# Altium project micromouse_a_DAT.PrjPcb
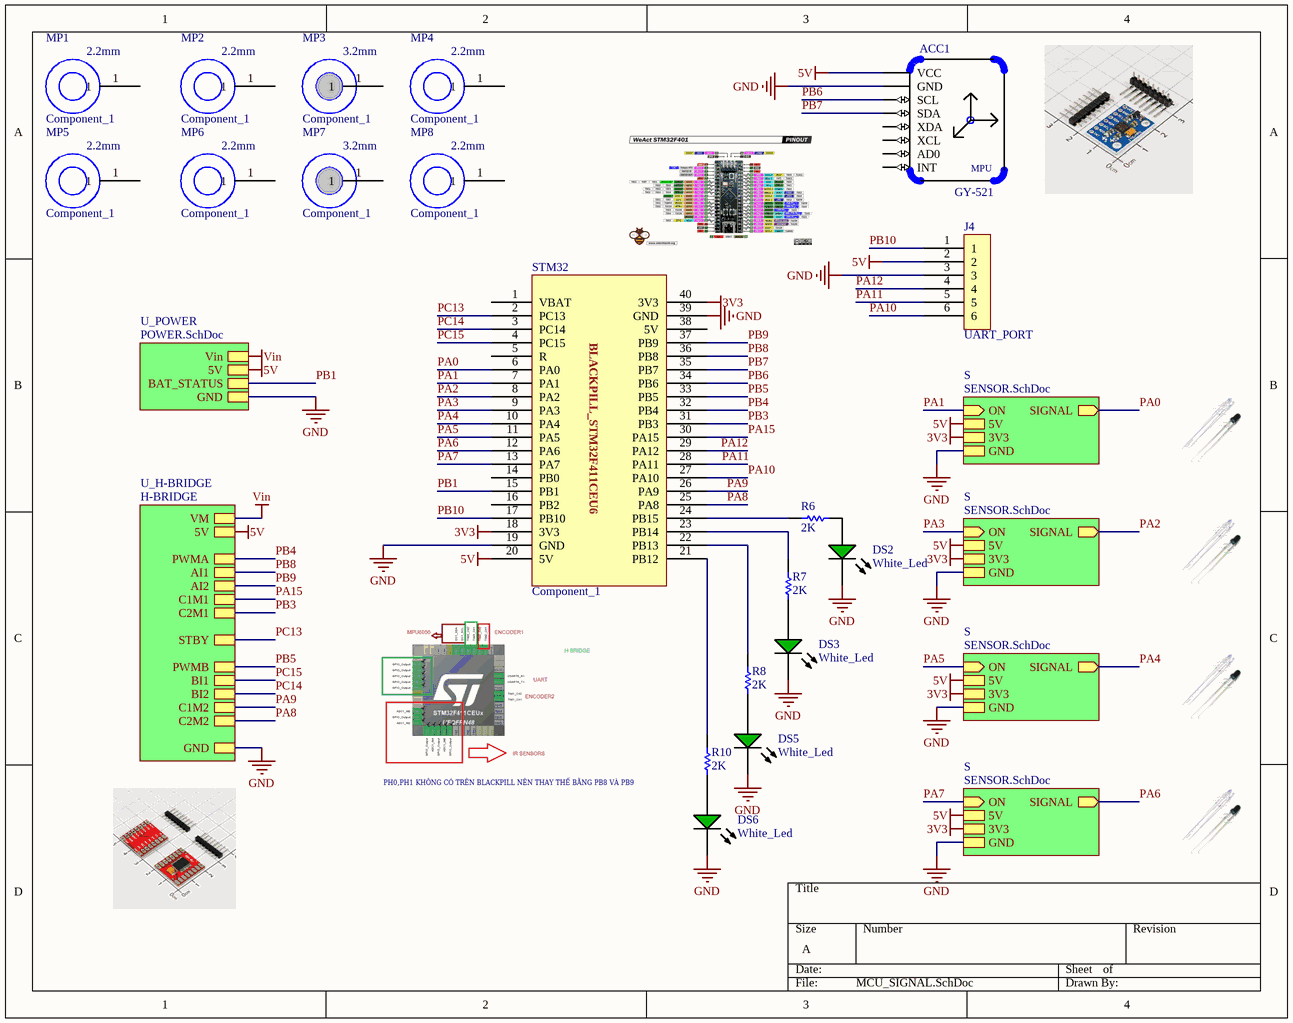
[diagram p0: MCU_SIGNAL.SchDoc]
4 sheets, 70 parts. Net scope: hierarchical (ports join the sheet entries above them; power ports are global).
Board file: PCB1.PcbDoc
Sheets:
  MCU_SIGNAL.SchDoc
    U_H-BRIDGE = H-BRIDGE.SchDoc
    S = SENSOR.SchDoc
    S = SENSOR.SchDoc
    S = SENSOR.SchDoc
    S = SENSOR.SchDoc
    U_POWER = POWER.SchDoc

## Sheet MCU_SIGNAL.SchDoc
size A; SheetNumber: 1; SheetTotal: 4

### Parts
ACC1  GY-521  [*GY-521_GY-521(Primary)]
DS2  White_Led  [AVAG-HSMX-C170_V]
DS3  White_Led  [AVAG-HSMX-C170_V]
DS5  White_Led  [AVAG-HSMX-C170_V]
DS6  White_Led  [AVAG-HSMX-C170_V]
J4  UART_PORT  [HDR Female 1~6 2.54mm]
MP1  Component_1  [PCBComponent_1]
MP2  Component_1  [PCBComponent_1]
MP3  Component_1  [PCBComponent_1]
MP4  Component_1  [PCBComponent_1]
MP5  Component_1  [PCBComponent_1]
MP6  Component_1  [PCBComponent_1]
MP7  Component_1  [PCBComponent_1]
MP8  Component_1  [PCBComponent_1]
R6  2K  [RESC2013X60X35ML10T20]
R7  2K  [RESC2013X60X35ML10T20]
R8  2K  [RESC2013X60X35ML10T20]
R10  2K  [RESC2013X60X35ML10T20]
STM32  Component_1  [MODULE_ZC323000]

### Sub-sheets
S = SENSOR.SchDoc: ON (in), SIGNAL (out), 5V, GND, 3V3
S = SENSOR.SchDoc: ON (in), SIGNAL (out), 5V, GND, 3V3
S = SENSOR.SchDoc: ON (in), SIGNAL (out), 5V, GND, 3V3
S = SENSOR.SchDoc: ON (in), SIGNAL (out), 5V, GND, 3V3
U_H-BRIDGE = H-BRIDGE: VM, 5V, PWMA, AI1, AI2, STBY, BI1, BI2, PWMB, GND, C1M1, C2M1, C1M2, C2M2
U_POWER = POWER.SchDoc: 5V, GND, Vin, BAT_STATUS

### Nets
3V3: STM32.18(3V3) STM32.40(3V3) ; sheet S/3V3, sheet S/3V3, sheet S/3V3, sheet S/3V3
5V: ACC1.VCC J4.2 STM32.20(5V) ; sheet U_H-BRIDGE/5V, sheet S/5V, sheet S/5V, sheet S/5V, sheet S/5V, sheet U_POWER/5V
GND: ACC1.GND DS2.2(K) DS3.2(K) DS5.2(K) DS6.2(K) J4.3 STM32.19(GND) STM32.39(GND) ; sheet U_H-BRIDGE/GND, sheet S/GND, sheet S/GND, sheet S/GND, sheet S/GND, sheet U_POWER/GND
Vin: sheet U_H-BRIDGE/VM, sheet U_POWER/Vin
PA0: STM32.6(PA0) ; sheet S/SIGNAL
PA1: STM32.7(PA1) ; sheet S/ON
PA2: STM32.8(PA2) ; sheet S/SIGNAL
PA3: STM32.9(PA3) ; sheet S/ON
PA4: STM32.10(PA4) ; sheet S/SIGNAL
PA5: STM32.11(PA5) ; sheet S/ON
PA6: STM32.12(PA6) ; sheet S/SIGNAL
PA7: STM32.13(PA7) ; sheet S/ON
PA8: STM32.25(PA8) ; sheet U_H-BRIDGE/C2M2
PA9: STM32.26(PA9) ; sheet U_H-BRIDGE/C1M2
PA10: J4.6 STM32.27(PA10)
PA11: J4.5 STM32.28(PA11)
PA12: J4.4 STM32.29(PA12)
PA15: STM32.30(PA15) ; sheet U_H-BRIDGE/C1M1
PB1: STM32.15(PB1) ; sheet U_POWER/BAT_STATUS
PB3: STM32.31(PB3) ; sheet U_H-BRIDGE/C2M1
PB4: STM32.32(PB4) ; sheet U_H-BRIDGE/PWMA
PB5: STM32.33(PB5) ; sheet U_H-BRIDGE/PWMB
PB6: ACC1.SCL STM32.34(PB6)
PB7: ACC1.SDA STM32.35(PB7)
PB8: STM32.36(PB8) ; sheet U_H-BRIDGE/AI1
PB9: STM32.37(PB9) ; sheet U_H-BRIDGE/AI2
PB10: J4.1 STM32.17(PB10)
PC13: STM32.2(PC13) ; sheet U_H-BRIDGE/STBY
PC14: STM32.3(PC14) ; sheet U_H-BRIDGE/BI2
PC15: STM32.4(PC15) ; sheet U_H-BRIDGE/BI1
NetDS2_1: DS2.1(A) R6.2
NetDS3_1: DS3.1(A) R7.1
NetDS5_1: DS5.1(A) R8.1
NetDS6_1: DS6.1(A) R10.1
NetR6_1: R6.1 STM32.24(PB15)
NetR7_2: R7.2 STM32.23(PB14)
NetR8_2: R8.2 STM32.22(PB13)
NetR10_2: R10.2 STM32.21(PB12)

Not connected (* = marked no-connect by the designer): ACC1 AD0 INT XCL XDA; MP1 1; MP2 1; MP3 1; MP4 1; MP5 1; MP6 1; MP7 1; MP8 1; STM32 1(VBAT) 5(R) 14(PB0) 16(PB2) 38(5V)

### Notes on the sheet
- PH0,PH1 KHÔNG CÓ TRÊN BLACKPILL NÊN THAY THẾ BẰNG PB8 VÀ PB9
- (in symbol Component_1) BLACKPILL_STM32F411CEU6; 2.2mm; 3.2mm
- (in symbol GY-521) MPU

### Library data of the parts
ACC1 = GY-521: Triple Axis Accelerometer Gyro Breakout; MF: GODREAM FORDREAM CO., LIMITED; SnapEDA_Link: https://www.snapeda.com/parts/GY-521/GODREAM+FORDREAM+CO.%252C+LIMITED/view-part/?ref=snap; Package: Package; MP: GY-521; Check_prices: https://www.snapeda.com/parts/GY-521/GODREAM+FORDREAM+CO.%252C+LIMITED/view-part/?ref=eda; Value: *
DS2 DS3 DS5 DS6 = CMP-2000-05062-1: Chip LED, Green, 2.2 V, -40 to 85 degC, 2-Pin SMD, Pb-Free, Tape and Reel; Manufacturer: Avago; No. of Pins: 2; Peak Wavelength: 570nm; SVHC: NoSVHC(16-Jun-2014); Dominant Wavelength: 572nm; Forward Current If: 20mA; Viewing Angle: 170deg; Lens Shape: Rectangular; PIV Max: 5V; External Width: 1.25mm; LED Type: Standard; External Depth: 0.8mm; Opto Mounting Orientation: Top; Luminous Intensity: 15mcd; Luminous Intensity Min: 4mcd; Forward Voltage VF Max: 2.6V; External Length / Height: 2mm; Bulb Size: 1.25mmx1.4mm; Light Area Height: 1mm; Voltage Vf Typ: 2.2V; Operating Temperature Max: 85degC; Datasheet Version: Oct-08; MSL: MSL2A-4weeks; Peak Forward Current: 20mA; Package Description: 2-Pin Surface Mount Device, Body 2 x 1.25 mm, Height 0.8 mm; Datasheet URL: https://datasheet.ciiva.com/29280/180495-da-01-en-chip-led-hsmg-c170-gelb-gruen-29280971.pdf; Storage Temperature Min: -40degC; LED Colour: Green; Wavelength Typ: 570nm; Mounting Type: SMD; Forward Current If Max: 20mA; Dominant Wavelength Typ: 572nm; LED Mounting: SMD; Operating Temperature Range: -30degCto+85degC; Operating Temperature Min: -30degC; Manufacturer URL: http://www.avagotech.com/; Packaging: CutTape; Luminous Intensity Typ: 15mcd; Package Reference: HSMX-C170; Storage Temperature Max: 85degC; Opto Case Style: SMD; Forward Voltage: 2.2V
J4 = M20-7820646: 06-WAY SIL VERT SOCKET L/FREE; Manufacturer: Harwin; Number of Contacts: 6; Gender: Female; Connector Type: Receptacle,Socket; Max Current Rating: 3A; Contact Resistance: 20mR; Pitch: 2.54mm; Manufacturer Part Number: M20-7820646; RoHS: Yes; Category: Headers and Wire Housings; Stock 1: 1563; Pricing 1: 1=0,96000, 10=0,84200, 100=0,72600, 500=0,59400, 1000=0,52800, 5000=0,46200, 10000=0,43890 (USD); Mount: Through Hole; Case/Package: SIL; Housing Material: Nylon; Color: Black; Contact Plating: Tin; Contact Material: Bronze; Housing Color: Black; Min Operating Temperature: -40°C; Max Operating Temperature: 105°C; Termination: Solder; Number of Rows: 1; Number of Positions: 6; Packaging: Rail/Tube; Orientation: Straight; Contact Gender: Female; Package Quantity: 38; Length: 15.64mm; Depth: 2.5mm; Radiation Hardening: No; ComponentLink1URL: http://components.arrow.com/part/dataview/0323_00725884?src-supplier=Arrow+Europe; ComponentLink1Description: http://components.arrow.com/part/dataview/0323_00725884?src-supplier=Arrow+Europe; ComponentLink2URL: http://www.harwin.com/include/downloads/pdfs/2010PAGE120.PDF?src-supplier=Avnet; ComponentLink2Description: http://www.harwin.com/include/downloads/pdfs/2010PAGE120.PDF?src-supplier=Avnet; ComponentLink3URL: https://cdn.harwin.com/pdfs/M20-782.pdf?src-supplier=Digi-Key; ComponentLink3Description: https://cdn.harwin.com/pdfs/M20-782.pdf?src-supplier=Digi-Key; ComponentLink4URL: https://cdn.harwin.com/pdfs/Harwin_PC_Connectors_M20.pdf?src-supplier=Avnet+Europe; ComponentLink4Description: https://cdn.harwin.com/pdfs/Harwin_PC_Connectors_M20.pdf?src-supplier=Avnet+Europe; ComponentLink5URL: https://cdn.harwin.com/pdfs/Harwin_PC_Connectors_M20.pdf?src-supplier=RSComponents; ComponentLink5Description: https://cdn.harwin.com/pdfs/Harwin_PC_Connectors_M20.pdf?src-supplier=RSComponents; ComponentLink6URL: https://cdn.harwin.com/pdfs/Harwin_PC_Connectors_M20.pdf?src-supplier=Mouser; ComponentLink6Description: https://cdn.harwin.com/pdfs/Harwin_PC_Connectors_M20.pdf?src-supplier=Mouser; ComponentLink7URL: https://cdn.harwin.com/pdfs/Harwin_PC_Connectors_M20.pdf?src-supplier=TTI; ComponentLink7Description: https://cdn.harwin.com/pdfs/Harwin_PC_Connectors_M20.pdf?src-supplier=TTI; Supplier 1: Digi-Key; Supplier Part Number 1: 952-1809-ND
R6-R8 R10 = CMP-2100-03671-1: Chip Resistor, 1 KOhm, +/- 1%, 125 mW, -55 to 155 degC, 0805 (2012 Metric), RoHS, Tape and Reel; Manufacturer: Yageo; Temperature Coefficient: 100ppm/degreesC; Voltage Rating (DC): 150V; Max Power Dissipation: 125mW; Resistance: 1KOhm; Number of Pins: 2; Number of Terminations: 2; Datasheet URL: http://www.yageo.com/NewPortal/yageodocoutput?fileName=/pdf/R-Chip/PYu-RC_Group_51_RoHS_L_5.pdf; Length: 0.079inch; Package Description: 2-Pin Surface Mounted Device, Body 2 x 1.25 mm; Depth: 1.25mm; Height: 0.024inch; Military Standard: Not; Case/Package: 0805; Package Reference: 0805; RoHSCompliant: true; Lead Free: LeadFree; Packaging: TapeandReel; Package Quantity: 1; Datasheet Version: Rev. 5, 10/2016; Tolerance: 1%; Min Operating Temperature: -55degC; Voltage Rating: 150V; Composition: ThickFilm; Case Code (Imperial): 0805; Power Rating: 125mW; Width: 0.049inch; Case Code (Metric): 2012; Manufacturer URL: http://www.yageo.com/; Max Operating Temperature: 155degC; REACH SVHC: Unknown; Termination: SMD/SMT

## Sheet H-BRIDGE.SchDoc
size A; SheetNumber: 3; SheetTotal: 4
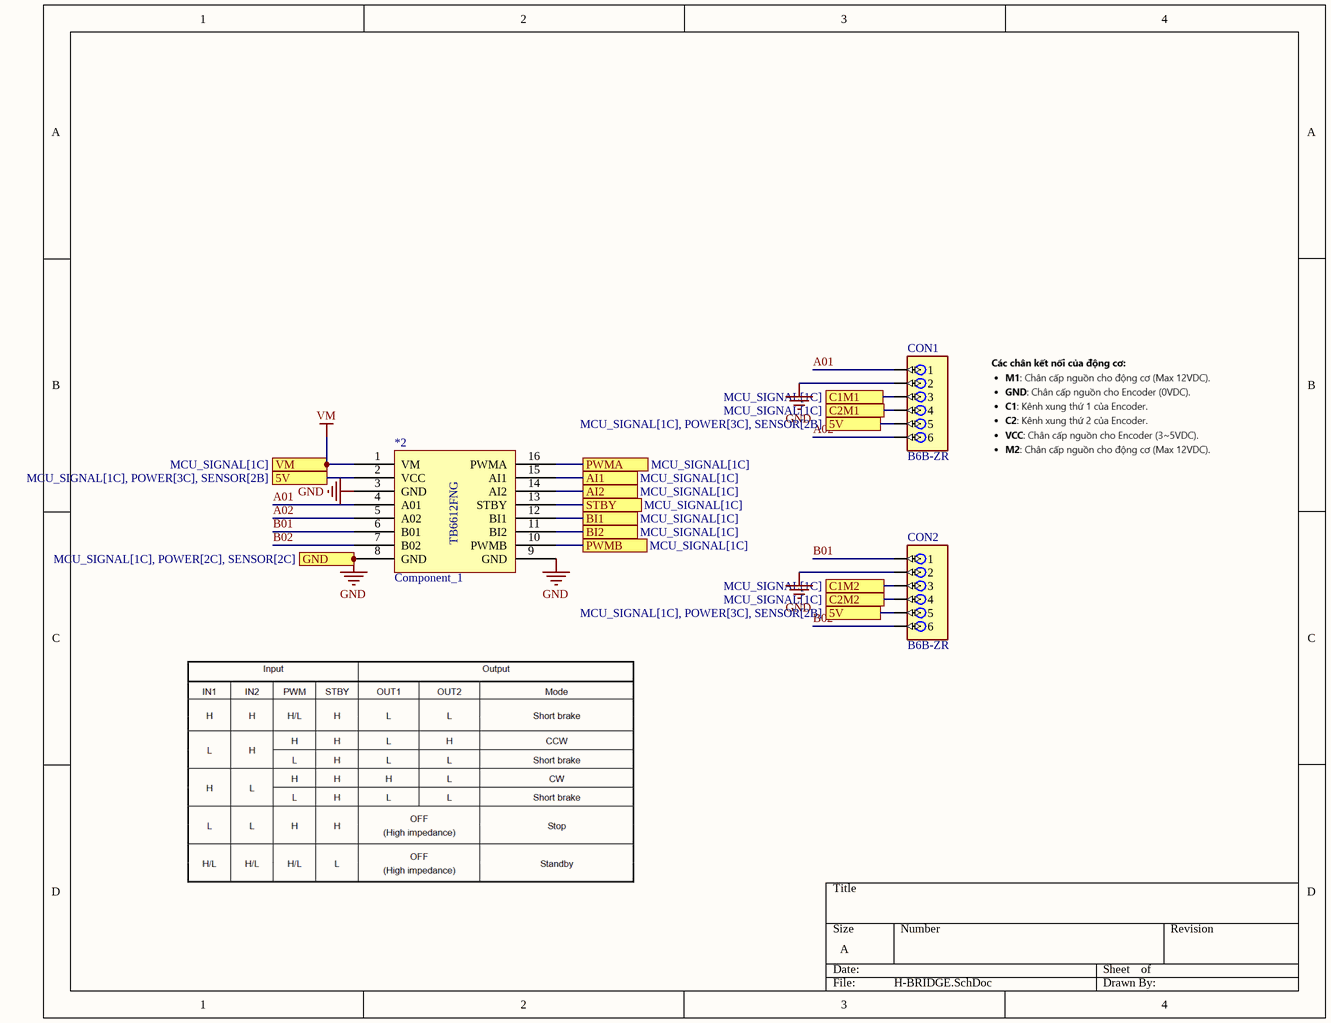
[diagram p1: H-BRIDGE.SchDoc]

### Parts
*2  Component_1  [PCBComponent_1]
CON1  B6B-ZR  [B6B-ZR]
CON2  B6B-ZR  [B6B-ZR]

### Ports
5V (see MCU_SIGNAL[1C], POWER[3C], SENSOR[2B]), AI1 (see MCU_SIGNAL[1C]), AI2 (see MCU_SIGNAL[1C]), BI1 (see MCU_SIGNAL[1C]), BI2 (see MCU_SIGNAL[1C]), C1M1 (see MCU_SIGNAL[1C]), C1M2 (see MCU_SIGNAL[1C]), C2M1 (see MCU_SIGNAL[1C]), C2M2 (see MCU_SIGNAL[1C]), GND (see MCU_SIGNAL[1C], POWER[2C], SENSOR[2C]), PWMA (see MCU_SIGNAL[1C]), PWMB (see MCU_SIGNAL[1C]), STBY (see MCU_SIGNAL[1C]), VM (see MCU_SIGNAL[1C])

### Nets
5V: *2.2(VCC) CON1.5 CON2.5 ; port 5V
GND: *2.3(GND) *2.8(GND) *2.9(GND) CON1.2 CON2.2 ; port GND
VM: *2.1(VM) ; port VM  [project net Vin]
A01: *2.4(A01) CON1.1
A02: *2.5(A02) CON1.6
B01: *2.6(B01) CON2.1
B02: *2.7(B02) CON2.6
PA8: CON2.4 ; port C2M2
PA9: CON2.3 ; port C1M2
PA15: CON1.3 ; port C1M1
PB3: CON1.4 ; port C2M1
PB4: *2.16(PWMA) ; port PWMA
PB5: *2.10(PWMB) ; port PWMB
PB8: *2.15(AI1) ; port AI1
PB9: *2.14(AI2) ; port AI2
PC13: *2.13(STBY) ; port STBY
PC14: *2.11(BI2) ; port BI2
PC15: *2.12(BI1) ; port BI1

### Notes on the sheet
- (in symbol Component_1) TB6612FNG

### Library data of the parts
CON1 CON2 = B6B-ZR: Connector Header Surface Mount 6 position 0.059 (1.50mm); MF: JST; Value: *; Check_prices: https://www.snapeda.com/parts/B6B-ZR/JST/view-part/?ref=eda; Price: None; MP: B6B-ZR; SnapEDA_Link: https://www.snapeda.com/parts/B6B-ZR/JST/view-part/?ref=snap; Availability: In Stock; Package: None

## Sheet SENSOR.SchDoc
size A; SheetNumber: 2; SheetTotal: 4
Used 4 times, as channels S, S, S, S. Parts and nets are listed once, with the designators drawn on the sheet.
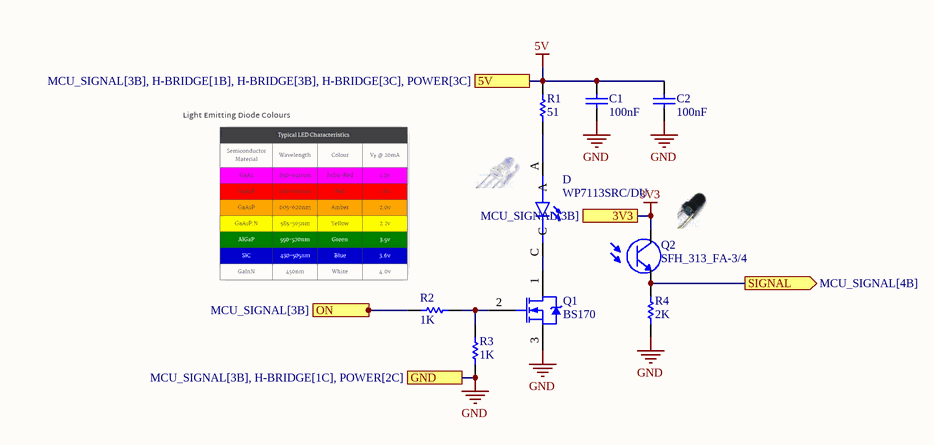
[diagram p2: SENSOR.SchDoc]

### Parts
C1  100nF  [CAPC2013X135X45LL10T25]
C2  100nF  [CAPC2013X135X45LL10T25]
D  WP7113SRC/DU  [LED_WP7113SRC/DU]
Q1  BS170  [ONSC-TO-92-3-29-11]
Q2  SFH_313_FA-3/4  [XDCR_SFH_313_FA-3/4]
R1  51  [RESC2013X60X35ML10T20]
R2  1K  [RESC2013X60X35ML10T20]
R3  1K  [RESC2013X60X35ML10T20]
R4  2K  [RESC2013X60X35ML10T20]

### Ports
3V3 (see MCU_SIGNAL[3B]), 5V (see MCU_SIGNAL[3B], H-BRIDGE[1B], H-BRIDGE[3B], H-BRIDGE[3C], POWER[3C]), GND (see MCU_SIGNAL[3B], H-BRIDGE[1C], POWER[2C]), ON (in, see MCU_SIGNAL[3B]), SIGNAL (out, see MCU_SIGNAL[4B])

### Nets
3V3: Q2.2(C) ; port 3V3
5V: C1.2 C2.2 R1.2 ; port 5V
GND: C1.1 C2.1 Q1.3(S) R3.1 R4.1 ; port GND
ON: R2.2 ; port ON
SIGNAL: Q2.1(E) R4.2 ; port SIGNAL
NetD_A: D.A R1.1
NetD_C: D.C Q1.1(D)
NetQ1_2: Q1.2(G) R2.1 R3.2

### Channels
S: designators end in _S#1; ports 3V3=3V3 5V=5V GND=GND ON=PA1 SIGNAL=PA0
S: designators end in _S#2; ports 3V3=3V3 5V=5V GND=GND ON=PA3 SIGNAL=PA2
S: designators end in _S#3; ports 3V3=3V3 5V=5V GND=GND ON=PA5 SIGNAL=PA4
S: designators end in _S#4; ports 3V3=3V3 5V=5V GND=GND ON=PA7 SIGNAL=PA6

### Library data of the parts
C1 C2 = CMP-1662-00015-2: Chip Capacitor, 4.7 uF, +/- 10%, 16 V, -55 to 85 degC, 0805 (2012 Metric), RoHS, Tape and Reel; PartNumber: GRM21BR61C475KA88L; Voltage Rating (DC): 16 V; Capacitance: 4.7 uF; Type (Capacitors): X5R; Case\/Package: 0805; Pins: 2; DatasheetVersion: 03/2016; REACH SVHC: No SVHC; Tolerance: 10%; Width: 1.25 mm; Mount: Surface Mount; ComponentLink1Description: Manufacturer URL; Case Code (Metric): 2012; PackageDescription: 2-Pin Surface Mount Device, Body 2 x 1.25 mm; Height: 1.25 mm; Voltage Rating: 16 V; Max Operating Temperature: 85 degC; RoHSCompliant: true; Length: 2 mm; ComponentLink1URL: http://www.murata.com/; Mounting Technology: Surface Mount; Packaging: Tape and Reel; Min Operating Temperature: -55 degC; ComponentLink2Description: Datasheet; Case Code (Imperial): 0805; Radiation Hardening: No; Package Quantity: 3000; PackageReference: 0805; ComponentLink2URL: http://search.murata.co.jp/Ceramy/image/img/A01X/G101/ENG/GRM21BR61C475KA88-01.pdf
D = WP7113SRC/DU: Red 640nm LED Indication - Discrete 1.85V Radial; MF: Kingbright; MP: WP7113SRC/DU; Value: *; SnapEDA_Link: https://www.snapeda.com/parts/WP7113SRC/DU/Kingbright/view-part/826988/?ref=snap; Price: None; Package: Radial Kingbright; Availability: Unavailable
Q1 = CMP-1058-00929-1: Small Signal MOSFET, 500 mA, 60 V, N-Channel, 3-Pin TO-92, Bulk Box; Manufacturer: On Semiconductor; VGS Max (V): 20; Configuration: Single; PD Max (W): 0.35; VGS(th) Max (V): 3; ID Max (A): 0.5; V(BR)DSS Min (V): 60; Channel Polarity: N Channel; PackageDescription: 3-Pin Transistor Outline, Body 4.825 x 3.685 mm, Pitch 1.27 mm; Package Type: TO-92; ComponentLink1Description: Manufacturer URL; ComponentLink1URL: http://www.onsemi.com/; DatasheetVersion: Rev. 6; ComponentLink3Description: Package Specification; PartNumber: BS170; ComponentLink2URL: http://www.onsemi.com/pub_link/Collateral/BS170-D.PDF; PackageVersion: Rev. AM; Mounting Technology: Through Hole; PackageReference: TO-92-3-29-11_AM_SL; ComponentLink2Description: Datasheet; ComponentLink3URL: http://www.onsemi.cn/pub_link/Collateral/2N6426-D.PDF; Packing: Bulk Box
Q2 = SFH_313_FA-3/4: Phototransistors 870nm Top View Radial - 2 Leads; MF: OSRAM Opto; MP: SFH 313 FA-3/4; Package: Radial-2 Osram Opto; Value: *; Check_prices: https://www.snapeda.com/parts/SFH%20313%20FA-3/4/OSRAM%20Opto%20Semiconductors%20Inc./view-part/240737/?ref=eda; Digi-Key_Part_Number: 475-3328-ND; SnapEDA_Link: https://www.snapeda.com/parts/SFH%20313%20FA-3/4/OSRAM%20Opto%20Semiconductors%20Inc./view-part/240737/?ref=snap
R1-R4 = CMP-2100-03671-1: as R6 on sheet MCU_SIGNAL; Number of Pins: 2; Number of Terminations: 2; Datasheet URL: http://www.yageo.com/NewPortal/yageodocoutput?fileName=/pdf/R-Chip/PYu-RC_Group_51_RoHS_L_5.pdf; Length: 0.079inch; Package Description: 2-Pin Surface Mounted Device, Body 2 x 1.25 mm; Depth: 1.25mm; Height: 0.024inch; Military Standard: Not; Case/Package: 0805; Package Reference: 0805; RoHSCompliant: true; Lead Free: LeadFree; Packaging: TapeandReel; Package Quantity: 1; Datasheet Version: Rev. 5, 10/2016; Tolerance: 1%; Min Operating Temperature: -55degC; Voltage Rating: 150V; Composition: ThickFilm; Case Code (Imperial): 0805; Power Rating: 125mW; Width: 0.049inch; Case Code (Metric): 2012; Manufacturer URL: http://www.yageo.com/; Max Operating Temperature: 155degC; REACH SVHC: Unknown; Termination: SMD/SMT

## Sheet POWER.SchDoc
size A; SheetNumber: 4; SheetTotal: 4
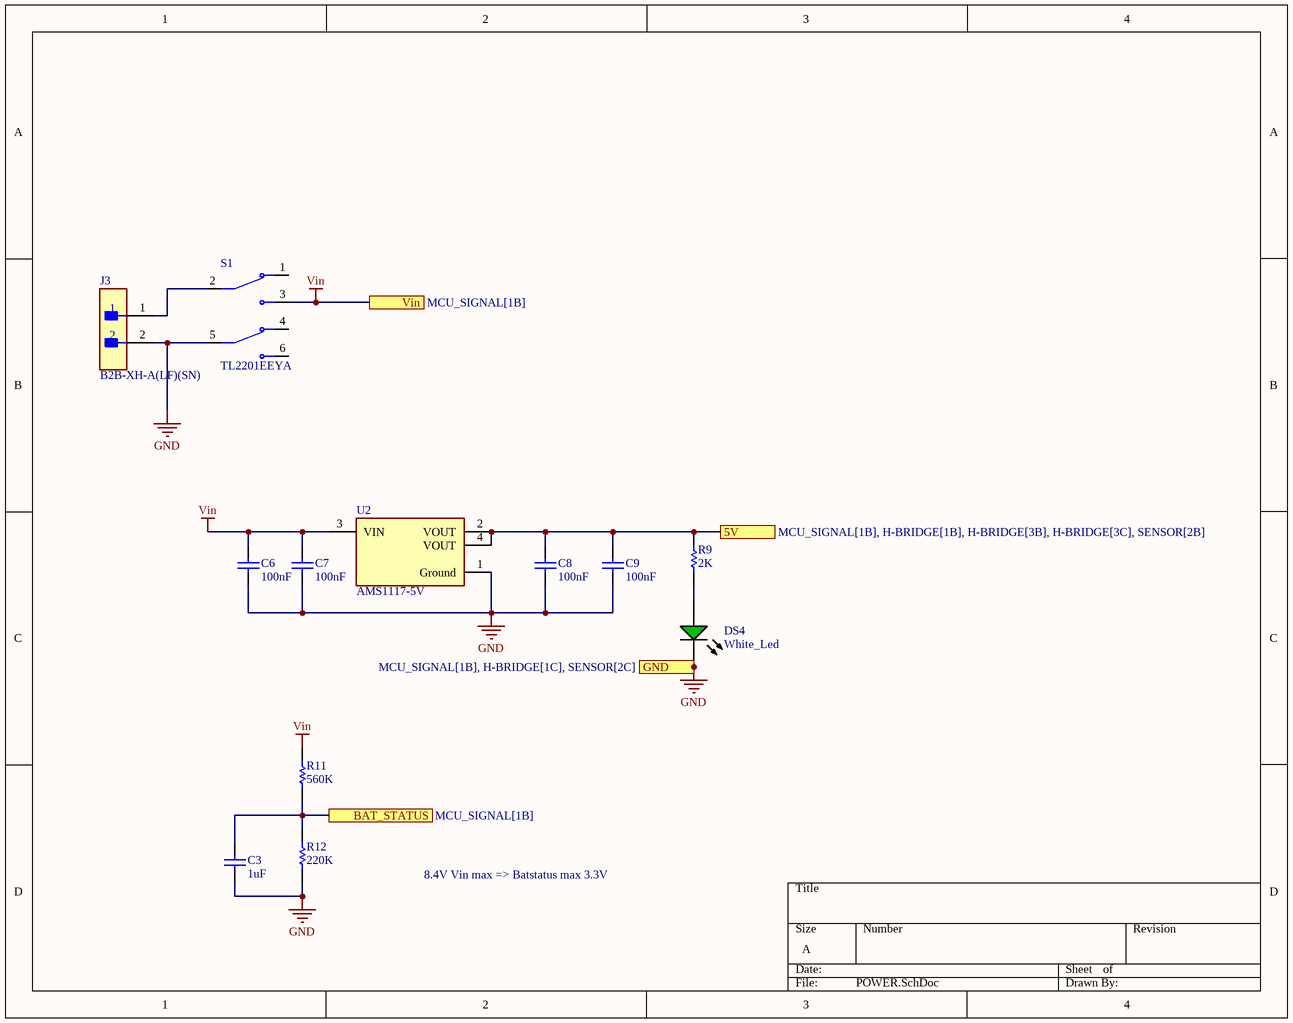
[diagram p3: POWER.SchDoc]

### Parts
C3  1uF  [CAPC2013X135X45LL10T25]
C6  100nF  [CAPC2013X135X45LL10T25]
C7  100nF  [CAPC2013X135X45LL10T25]
C8  100nF  [CAPC2013X135X45LL10T25]
C9  100nF  [CAPC2013X135X45LL10T25]
DS4  White_Led  [AVAG-HSMX-C170_V]
J3  B2B-XH-A(LF)(SN)  [FP-B2B-XH-A_LF_SN-MFG]
R9  2K  [RESC2013X60X35ML10T20]
R11  560K  [RESC2013X60X35ML10T20]
R12  220K  [RESC2013X60X35ML10T20]
S1  TL2201EEYA  [SW_TL2201EEYA]
U2  AMS1117-5V  [FP-AMS1117-IPC_C]

### Ports
5V (see MCU_SIGNAL[1B], H-BRIDGE[1B], H-BRIDGE[3B], H-BRIDGE[3C], SENSOR[2B]), BAT_STATUS (see MCU_SIGNAL[1B]), GND (see MCU_SIGNAL[1B], H-BRIDGE[1C], SENSOR[2C]), Vin (see MCU_SIGNAL[1B])

### Nets
5V: C8.2 C9.2 R9.2 U2.2(VOUT) U2.4(VOUT) ; port 5V
GND: C3.1 C6.1 C7.1 C8.1 C9.1 DS4.2(K) J3.2 R12.1 S1.5 U2.1(Ground) ; port GND
Vin: C6.2 C7.2 R11.2 S1.3 U2.3(VIN) ; port Vin
PB1: C3.2 R11.1 R12.2 ; port BAT_STATUS
NetDS4_1: DS4.1(A) R9.1
NetJ3_1: J3.1 S1.2

Not connected (* = marked no-connect by the designer): S1 1 4 6

### Notes on the sheet
- 8.4V Vin max => Batstatus max 3.3V

### Library data of the parts
C3 C6-C9 = CMP-1662-00015-2: as C1 on sheet SENSOR; Pins: 2; DatasheetVersion: 03/2016; REACH SVHC: No SVHC; Tolerance: 10%; Width: 1.25 mm; Mount: Surface Mount; ComponentLink1Description: Manufacturer URL; Case Code (Metric): 2012; PackageDescription: 2-Pin Surface Mount Device, Body 2 x 1.25 mm; Height: 1.25 mm; Voltage Rating: 16 V; Max Operating Temperature: 85 degC; RoHSCompliant: true; Length: 2 mm; ComponentLink1URL: http://www.murata.com/; Mounting Technology: Surface Mount; Packaging: Tape and Reel; Min Operating Temperature: -55 degC; ComponentLink2Description: Datasheet; Case Code (Imperial): 0805; Radiation Hardening: No; Package Quantity: 3000; PackageReference: 0805; ComponentLink2URL: http://search.murata.co.jp/Ceramy/image/img/A01X/G101/ENG/GRM21BR61C475KA88-01.pdf
DS4 = CMP-2000-05062-1: as DS2 on sheet MCU_SIGNAL; Operating Temperature Max: 85degC; Datasheet Version: Oct-08; MSL: MSL2A-4weeks; Peak Forward Current: 20mA; Package Description: 2-Pin Surface Mount Device, Body 2 x 1.25 mm, Height 0.8 mm; Datasheet URL: https://datasheet.ciiva.com/29280/180495-da-01-en-chip-led-hsmg-c170-gelb-gruen-29280971.pdf; Storage Temperature Min: -40degC; LED Colour: Green; Wavelength Typ: 570nm; Mounting Type: SMD; Forward Current If Max: 20mA; Dominant Wavelength Typ: 572nm; LED Mounting: SMD; Operating Temperature Range: -30degCto+85degC; Operating Temperature Min: -30degC; Manufacturer URL: http://www.avagotech.com/; Packaging: CutTape; Luminous Intensity Typ: 15mcd; Package Reference: HSMX-C170; Storage Temperature Max: 85degC; Opto Case Style: SMD; Forward Voltage: 2.2V
J3 = CMP-2000-05888-3: CONN HEADER VERT 2POS 2.5MM; Current Rating: 3A; Voltage Rating: 250V; Number of Contacts: 2; Contact Resistance: 20mR; Wire/Cable Gauge: 22AWG; Insulation Resistance: 1GR; Connector Type: Male Pin; Packaging: Bulk; Contact Material: Brass; Lead Free: Lead Free; Orientation: Straight; Contact Plating: Tin; Max Current Rating: 3A; Termination: Solder; Fastening Type: Detent; Depth: 5.75mm; Housing Material: Polyamide; REACH SVHC: No SVHC; Series: XH; Voltage Rating (AC): 250V; Number of Positions: 2; Color: Natural; Contact Type: Male Pin; Max Voltage Rating (DC): 250V; Pitch: 2.5mm; Lead Pitch: 2.5mm; Mount: Through Hole; Max Operating Temperature: 85°C; Length: 7.4mm; Max Voltage Rating (AC): 250V; Min Operating Temperature: -25°C; Number of Rows: 1; Housing Color: White
R9 R11 R12 = CMP-2100-03671-1: as R6 on sheet MCU_SIGNAL; Number of Pins: 2; Number of Terminations: 2; Datasheet URL: http://www.yageo.com/NewPortal/yageodocoutput?fileName=/pdf/R-Chip/PYu-RC_Group_51_RoHS_L_5.pdf; Length: 0.079inch; Package Description: 2-Pin Surface Mounted Device, Body 2 x 1.25 mm; Depth: 1.25mm; Height: 0.024inch; Military Standard: Not; Case/Package: 0805; Package Reference: 0805; RoHSCompliant: true; Lead Free: LeadFree; Packaging: TapeandReel; Package Quantity: 1; Datasheet Version: Rev. 5, 10/2016; Tolerance: 1%; Min Operating Temperature: -55degC; Voltage Rating: 150V; Composition: ThickFilm; Case Code (Imperial): 0805; Power Rating: 125mW; Width: 0.049inch; Case Code (Metric): 2012; Manufacturer URL: http://www.yageo.com/; Max Operating Temperature: 155degC; REACH SVHC: Unknown; Termination: SMD/SMT
S1 = TL2201EEYA: Pushbutton Switch DPDT Standard Through Hole; MF: E-Switch; Availability: In Stock; Check_prices: https://www.snapeda.com/parts/TL2201EEYA/E-Switch/view-part/?ref=eda; SnapEDA_Link: https://www.snapeda.com/parts/TL2201EEYA/E-Switch/view-part/?ref=snap; Purchase-URL: https://pricing.snapeda.com/search/part/TL2201EEYA/?ref=eda; Package: None; MP: TL2201EEYA; Value: *; Price: None
U2 = CMP-209535-000001-1: LDO Voltage Regulators 1A, 3.3V; Manufacturer Part Number: AMS1117-3.3; Manufacturer: Advanced Monolithic Systems; Dropout Voltage: 1.1V; Output Type: Fixed; Nominal Supply Current: 5mA; Max Power Dissipation: 1.2W; Max Supply Voltage: 15V; Number Of Outputs: 1; Standoff Height: 0.64mm; Max Junction Temp: +125°C; Height: 1.8mm; Package: AMS1117; Device Class L2: Power Management ICs; ComponentLink2Description: Datasheet; ComponentLink2URL: http://www.advanced-monolithic.com/pdf/ds1117.pdf; Category: IC; RoHS: TRUE; Automotive: No; Device Class L1: Integrated Circuits (ICs); Output Current: 1A; Device Class L3: Voltage Regulators - Linear; Temperature: -40°C to +125°C; Output Voltage: 3.3V; Temperature Range Low: -40°C; Octopart: https://octopart.com/ams1117-3.3-advanced+monolithic+systems-25899300; Lead Free: Yes; Ipc Land Pattern Name: SOT229P700X180-4; Temperature Range High: +125°C

## Nets that join several sheets
3V3: MCU_SIGNAL (STM32.18 STM32.40), S (Q2_S#1.2), S (Q2_S#2.2), S (Q2_S#3.2), S (Q2_S#4.2)
5V: MCU_SIGNAL (ACC1.VCC J4.2 STM32.20), H-BRIDGE (*2.2 CON1.5 CON2.5), S (C1_S#1.2 C2_S#1.2 R1_S#1.2), S (C1_S#2.2 C2_S#2.2 R1_S#2.2), S (C1_S#3.2 C2_S#3.2 R1_S#3.2), S (C1_S#4.2 C2_S#4.2 R1_S#4.2), POWER (5 pins)
GND: MCU_SIGNAL (8 pins), H-BRIDGE (5 pins), S (5 pins), S (5 pins), S (5 pins), S (5 pins), POWER (10 pins)
Vin: H-BRIDGE (*2.1), POWER (5 pins)
PA0: MCU_SIGNAL (STM32.6), S (Q2_S#1.1 R4_S#1.2)
PA1: MCU_SIGNAL (STM32.7), S (R2_S#1.2)
PA2: MCU_SIGNAL (STM32.8), S (Q2_S#2.1 R4_S#2.2)
PA3: MCU_SIGNAL (STM32.9), S (R2_S#2.2)
PA4: MCU_SIGNAL (STM32.10), S (Q2_S#3.1 R4_S#3.2)
PA5: MCU_SIGNAL (STM32.11), S (R2_S#3.2)
PA6: MCU_SIGNAL (STM32.12), S (Q2_S#4.1 R4_S#4.2)
PA7: MCU_SIGNAL (STM32.13), S (R2_S#4.2)
PA8: MCU_SIGNAL (STM32.25), H-BRIDGE (CON2.4)
PA9: MCU_SIGNAL (STM32.26), H-BRIDGE (CON2.3)
PA15: MCU_SIGNAL (STM32.30), H-BRIDGE (CON1.3)
PB1: MCU_SIGNAL (STM32.15), POWER (C3.2 R11.1 R12.2)
PB3: MCU_SIGNAL (STM32.31), H-BRIDGE (CON1.4)
PB4: MCU_SIGNAL (STM32.32), H-BRIDGE (*2.16)
PB5: MCU_SIGNAL (STM32.33), H-BRIDGE (*2.10)
PB8: MCU_SIGNAL (STM32.36), H-BRIDGE (*2.15)
PB9: MCU_SIGNAL (STM32.37), H-BRIDGE (*2.14)
PC13: MCU_SIGNAL (STM32.2), H-BRIDGE (*2.13)
PC14: MCU_SIGNAL (STM32.3), H-BRIDGE (*2.11)
PC15: MCU_SIGNAL (STM32.4), H-BRIDGE (*2.12)